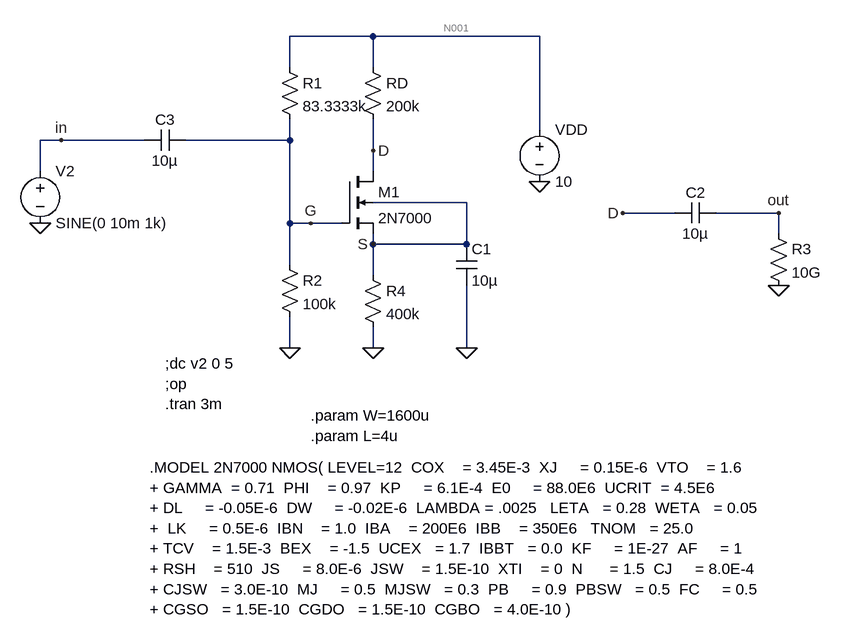
[diagram p0: schematic 2n7000_ekv_VT_KN.asc]
2n7000_ekv_VT_KN.asc, the LTspice schematic file:
Version 4
SHEET 1 2092 1428
WIRE 352 -176 224 -176
WIRE 608 -176 352 -176
WIRE 224 -128 224 -176
WIRE 352 -128 352 -176
WIRE 608 -32 608 -176
WIRE -128 -16 -160 -16
WIRE 0 -16 -128 -16
WIRE 224 -16 224 -48
WIRE 224 -16 64 -16
WIRE 352 0 352 -48
WIRE -160 32 -160 -16
WIRE 352 32 352 0
WIRE 496 80 352 80
WIRE 816 96 736 96
WIRE 976 96 880 96
WIRE 224 112 224 -16
WIRE 256 112 224 112
WIRE 304 112 256 112
WIRE 976 128 976 96
WIRE 352 144 352 128
WIRE 496 144 496 80
WIRE 496 144 352 144
WIRE 224 176 224 112
WIRE 352 192 352 144
WIRE 224 304 224 256
WIRE 352 304 352 272
WIRE 496 304 496 208
FLAG 608 48 0
FLAG -160 112 0
FLAG 352 304 0
FLAG 352 0 D
FLAG 496 304 0
FLAG 976 208 0
FLAG 736 96 D
FLAG 976 96 out
FLAG 224 304 0
FLAG -128 -16 in
FLAG 256 112 G
FLAG 352 144 S
SYMBOL nmos4 304 32 R0
SYMATTR InstName M1
SYMATTR Value2 l={L} w={W}
SYMATTR Value 2N7000
SYMBOL voltage 608 -48 R0
WINDOW 123 0 0 Left 2
WINDOW 39 0 0 Left 2
SYMATTR InstName VDD
SYMATTR Value 10
SYMBOL res 336 -144 R0
SYMATTR InstName RD
SYMATTR Value 200k
SYMBOL voltage -160 16 R0
WINDOW 123 0 0 Left 0
WINDOW 39 0 0 Left 0
SYMATTR InstName V2
SYMATTR Value SINE(0 10m 1k)
SYMBOL cap 480 144 R0
SYMATTR InstName C1
SYMATTR Value 10µ
SYMBOL cap 880 80 R90
WINDOW 0 0 32 VBottom 2
WINDOW 3 32 32 VTop 2
SYMATTR InstName C2
SYMATTR Value 10µ
SYMBOL res 960 112 R0
SYMATTR InstName R3
SYMATTR Value 10G
SYMBOL res 208 -144 R0
SYMATTR InstName R1
SYMATTR Value 83.3333k
SYMBOL res 208 160 R0
SYMATTR InstName R2
SYMATTR Value 100k
SYMBOL res 336 176 R0
SYMATTR InstName R4
SYMATTR Value 400k
SYMBOL cap 64 -32 R90
WINDOW 0 0 32 VBottom 2
WINDOW 3 32 32 VTop 2
SYMATTR InstName C3
SYMATTR Value 10µ
TEXT 8 488 Left 2 !.MODEL 2N7000 NMOS( LEVEL=12  COX    = 3.45E-3  XJ     = 0.15E-6  VTO    = 1.6\n+ GAMMA  = 0.71  PHI    = 0.97  KP     = 6.1E-4  E0     = 88.0E6  UCRIT  = 4.5E6 \n+ DL     = -0.05E-6  DW     = -0.02E-6  LAMBDA = .0025   LETA   = 0.28  WETA   = 0.05 \n+  LK     = 0.5E-6  IBN    = 1.0  IBA    = 200E6  IBB    = 350E6   TNOM   = 25.0 \n+ TCV    = 1.5E-3  BEX    = -1.5  UCEX   = 1.7  IBBT   = 0.0  KF     = 1E-27  AF     = 1 \n+ RSH    = 510  JS     = 8.0E-6  JSW    = 1.5E-10  XTI    = 0  N      = 1.5  CJ     = 8.0E-4 \n+ CJSW   = 3.0E-10  MJ     = 0.5  MJSW   = 0.3  PB     = 0.9  PBSW   = 0.5  FC     = 0.5 \n+ CGSO   = 1.5E-10  CGDO   = 1.5E-10  CGBO   = 4.0E-10 )
TEXT 32 328 Left 2 !;dc v2 0 5\n;op\n.tran 3m
TEXT 256 408 Left 2 !.param W=1600u\n.param L=4u

The netlist it stands for:
* 2n7000_ekv_VT_KN.asc
M1 D G S S 2N7000 l={L} w={W}
VDD N001 0 10
RD N001 D 200k
V2 in 0 SINE(0 10m 1k)
C1 S 0 10µ
C2 out D 10µ
R3 out 0 10G
R1 N001 G 83.3333k
R2 G 0 100k
R4 S 0 400k
C3 G in 10µ
.model NMOS NMOS
.model PMOS PMOS
.lib standard.mos
.MODEL 2N7000 NMOS( LEVEL=12  COX    = 3.45E-3  XJ     = 0.15E-6  VTO    = 1.6
+ GAMMA  = 0.71  PHI    = 0.97  KP     = 6.1E-4  E0     = 88.0E6  UCRIT  = 4.5E6
+ DL     = -0.05E-6  DW     = -0.02E-6  LAMBDA = .0025   LETA   = 0.28  WETA   = 0.05
+  LK     = 0.5E-6  IBN    = 1.0  IBA    = 200E6  IBB    = 350E6   TNOM   = 25.0
+ TCV    = 1.5E-3  BEX    = -1.5  UCEX   = 1.7  IBBT   = 0.0  KF     = 1E-27  AF     = 1
+ RSH    = 510  JS     = 8.0E-6  JSW    = 1.5E-10  XTI    = 0  N      = 1.5  CJ     = 8.0E-4
+ CJSW   = 3.0E-10  MJ     = 0.5  MJSW   = 0.3  PB     = 0.9  PBSW   = 0.5  FC     = 0.5
+ CGSO   = 1.5E-10  CGDO   = 1.5E-10  CGBO   = 4.0E-10 )
;dc v2 0 5
;op
.tran 3m
.param W=1600u
.param L=4u
.backanno
.end

* Results of the author's LTspice run, read from the files saved beside the schematic
* Operating Point, zero values left out:
*   V(d) = 8 V
*   V(g) = 5.455 V
*   V(s) = 4.001 V
*   V(n001) = 10 V
*   V(out) = 800 nV
*   Id(M1) = 10 µA
*   Ib(M1) = -63.01 nA
*   Is(M1) = -9.939 µA
*   I(R4) = 10 µA
*   I(R2) = 54.55 µA
*   I(R1) = 54.55 µA
*   I(Rd) = 10 µA
*   I(Vdd) = -64.55 µA
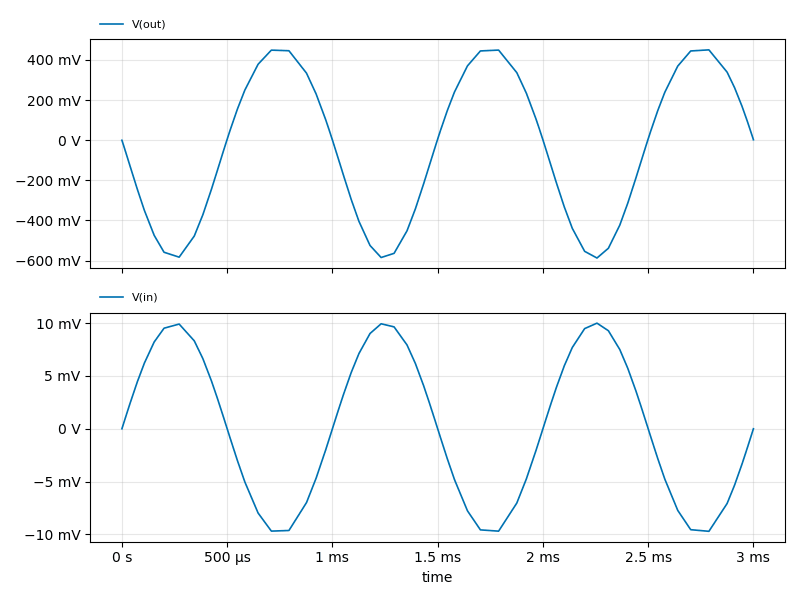
[diagram p1: Transient Analysis of 2n7000_ekv_VT_KN.asc, plotted from the saved traces]
* Transient Analysis, 1 run:
*   V(out): min -587.1 mV, max 450.4 mV, average -30.62 mV, rms 369.5 mV, last 2.497 mV
*   V(in): min -9.704 mV, max 9.991 mV, average 24.47 µV, rms 7.009 mV, last 0 V